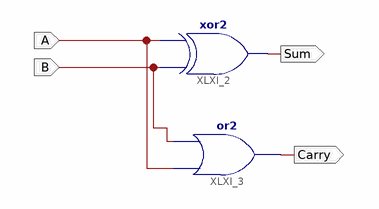
[diagram p0: schematic sheet 1]
// Xilinx ISE schematic Half_Adder.sch (spartan3) as structural Verilog: 2 symbols, 4 ports
module Half_Adder (
  input  A,
  input  B,
  output Sum,
  output Carry
);

  xor XLXI_2 (Sum, B, A);
  or XLXI_3 (Carry, A, B);
endmodule
